# EAGLE design Bus_isolator_trager (EAGLE 6.6.0)
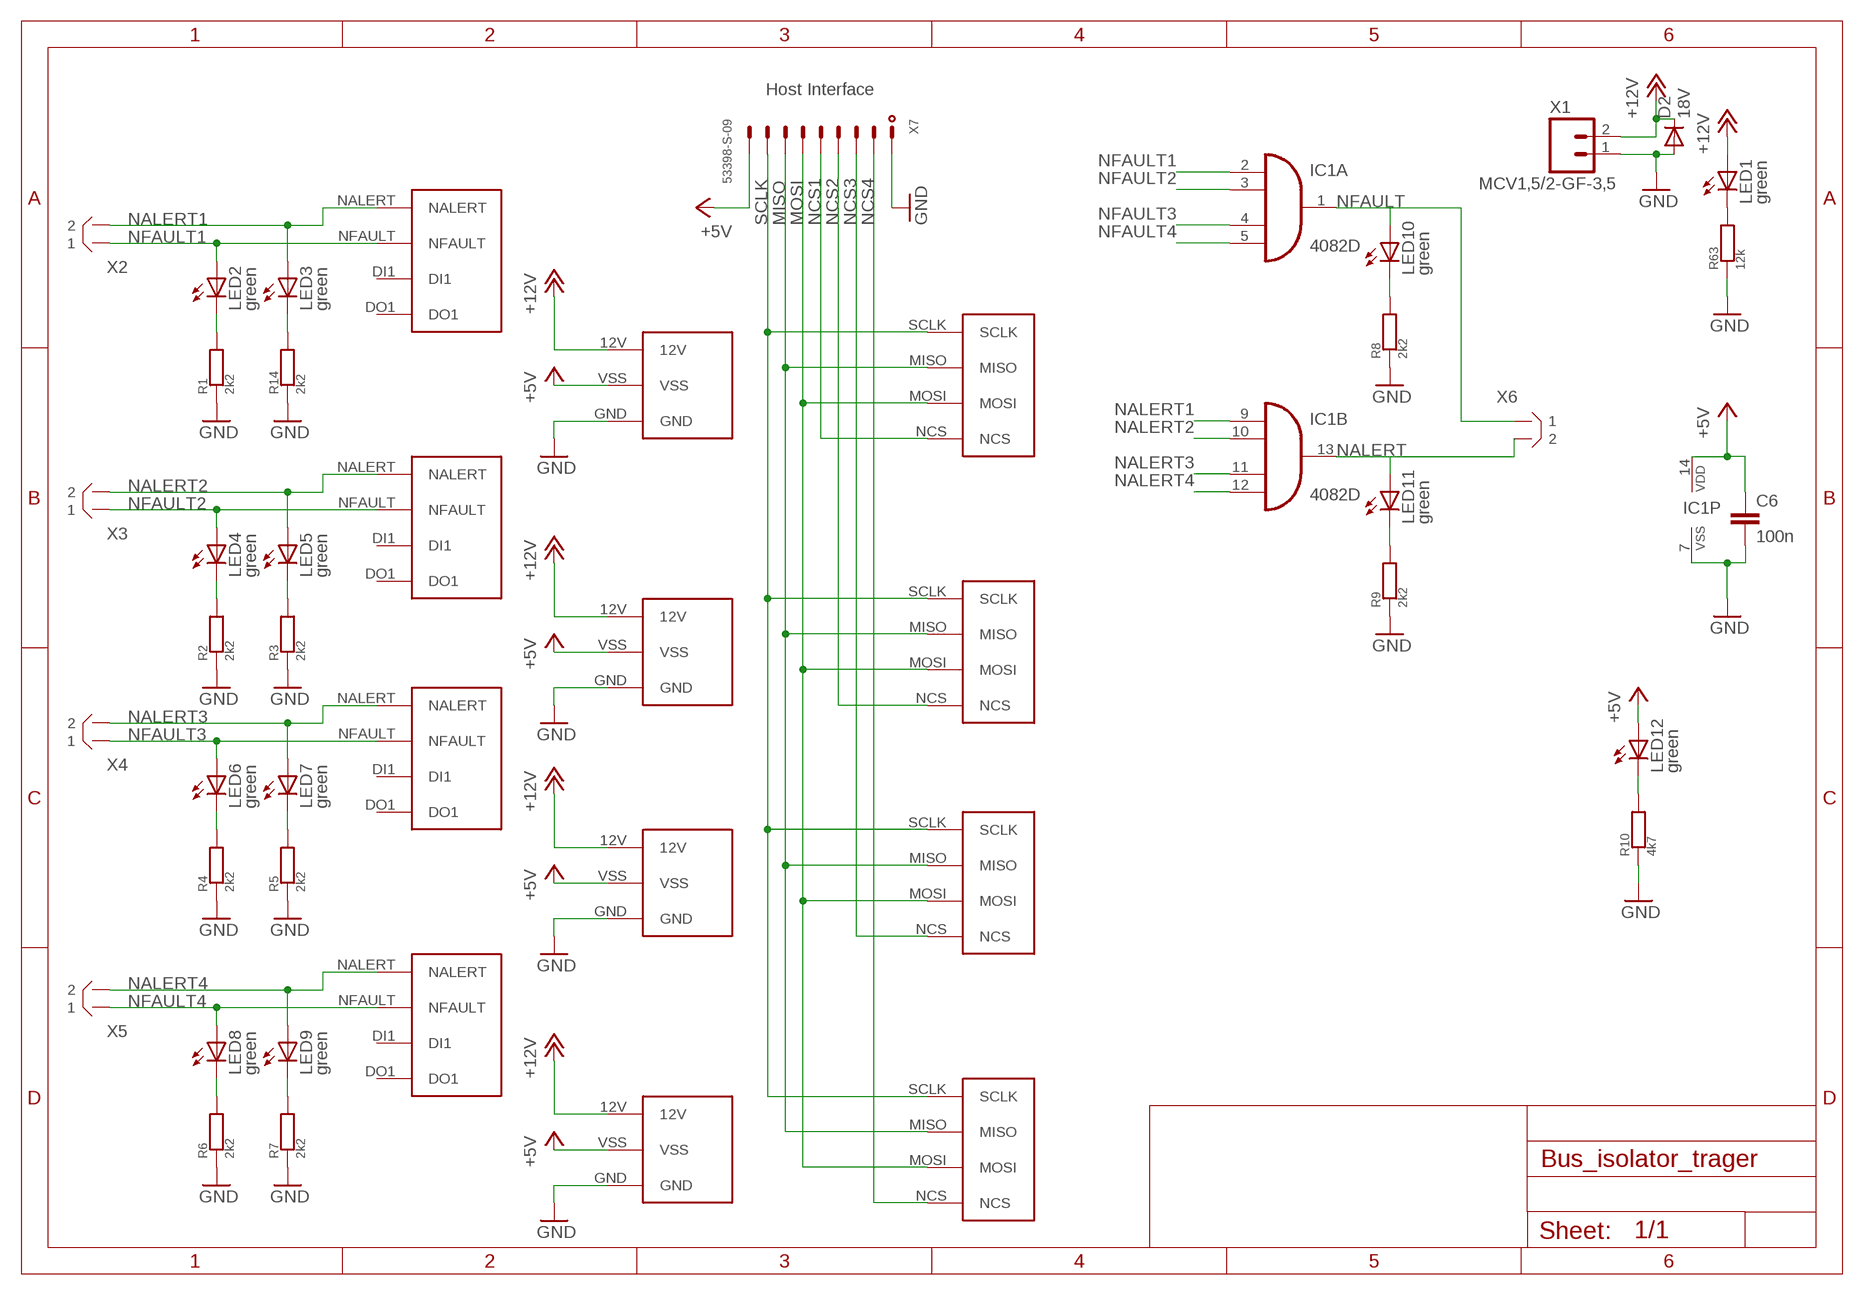
[diagram p0: schematic, sheet 1]

## Parts
A1  SPI_ISOLATOR_V4  [SPI_ISOLATOR_V4]
A2  SPI_ISOLATOR_V4  [SPI_ISOLATOR_V4]
A3  SPI_ISOLATOR_V4  [SPI_ISOLATOR_V4]
A4  SPI_ISOLATOR_V4  [SPI_ISOLATOR_V4]
C6  100n  C-EUC0603  [C0603]
D2  18V  DIODE-DO214AA  [DO214AA]
IC1  4082D  [SO14]
LED1  green  LEDCHIP-LED0805  [CHIP-LED0805]
LED2  green  LEDCHIPLED_0805  [CHIPLED_0805]
LED3  green  LEDCHIPLED_0805  [CHIPLED_0805]
LED4  green  LEDCHIPLED_0805  [CHIPLED_0805]
LED5  green  LEDCHIPLED_0805  [CHIPLED_0805]
LED6  green  LEDCHIPLED_0805  [CHIPLED_0805]
LED7  green  LEDCHIPLED_0805  [CHIPLED_0805]
LED8  green  LEDCHIPLED_0805  [CHIPLED_0805]
LED9  green  LEDCHIPLED_0805  [CHIPLED_0805]
LED10  green  LEDCHIPLED_0805  [CHIPLED_0805]
LED11  green  LEDCHIPLED_0805  [CHIPLED_0805]
LED12  green  LEDCHIP-LED0805  [CHIP-LED0805]
R1  2k2  R0603  [R0603]
R2  2k2  R0603  [R0603]
R3  2k2  R0603  [R0603]
R4  2k2  R0603  [R0603]
R5  2k2  R0603  [R0603]
R6  2k2  R0603  [R0603]
R7  2k2  R0603  [R0603]
R8  2k2  R0603  [R0603]
R9  2k2  R0603  [R0603]
R10  4k7  R0603  [R0603]
R14  2k2  R0603  [R0603]
R63  12k  R0603  [R0603]
X1  MCV1,5/2-GF-3,5  [MCV1,5/2-GF-3,5]
X2  B2B-XH  [B2B-XH]
X3  B2B-XH  [B2B-XH]
X4  B2B-XH  [B2B-XH]
X5  B2B-XH  [B2B-XH]
X6  B2B-XH  [B2B-XH]
X7  53398-S-09  [53398-09-S]

## Nets
+5V: A1.VSS A2.VSS A3.VSS A4.VSS C6.1 IC1.14(P:VDD) LED12.A X7.9
+12V: A1.12V A2.12V A3.12V A4.12V D2.C LED1.A X1.2
GND: A1.GND A2.GND A3.GND A4.GND C6.2 D2.A IC1.7(P:VSS) R1.1 R2.1 R3.1 R4.1 R5.1 R6.1 R7.1 R8.1 R9.1 R10.1 R14.1 R63.1 X1.1 X7.1
MISO: A1.MISO A2.MISO A3.MISO A4.MISO X7.7
MOSI: A1.MOSI A2.MOSI A3.MOSI A4.MOSI X7.6
N$1: LED2.C R1.2
N$2: LED4.C R2.2
N$3: LED5.C R3.2
N$4: LED6.C R4.2
N$5: LED7.C R5.2
N$6: LED8.C R6.2
N$7: LED9.C R7.2
N$8: LED10.C R8.2
N$9: LED11.C R9.2
N$10: LED12.C R10.2
N$29: LED3.C R14.2
N$54: LED1.C R63.2
NALERT: IC1.13(B:O) LED11.A X6.P$2
NALERT1: A1.NALERT IC1.9(B:I0) LED3.A X2.P$2
NALERT2: A2.NALERT IC1.10(B:I1) LED5.A X3.P$2
NALERT3: A3.NALERT IC1.11(B:I2) LED7.A X4.P$2
NALERT4: A4.NALERT IC1.12(B:I3) LED9.A X5.P$2
NCS1: A1.NCS X7.5
NCS2: A2.NCS X7.4
NCS3: A3.NCS X7.3
NCS4: A4.NCS X7.2
NFAULT: IC1.1(A:O) LED10.A X6.P$1
NFAULT1: A1.NFAULT IC1.2(A:I0) LED2.A X2.P$1
NFAULT2: A2.NFAULT IC1.3(A:I1) LED4.A X3.P$1
NFAULT3: A3.NFAULT IC1.4(A:I2) LED6.A X4.P$1
NFAULT4: A4.NFAULT IC1.5(A:I3) LED8.A X5.P$1
SCLK: A1.SCLK A2.SCLK A3.SCLK A4.SCLK X7.8
Unconnected: A1.DI1 A1.DO1 A2.DI1 A2.DO1 A3.DI1 A3.DO1 A4.DI1 A4.DO1

## Notes on the sheet
- Host Interface

## Library data of the parts
A1-A4 = tera-boards:SPI_ISOLATOR_V4
C6 = rcl:C-EU: CAPACITOR, European symbol
D2 = diode:DIODE-: DIODE
IC1 = 40xx:4082: Dual 4-input AND
LED1-LED12 = led:LED: LED OSRAM: - CHIPLED LG R971, LG N971, LY N971, LG Q971, LY Q971, LO R971, LY R971 LH N974, LH R974 LS Q976, LO Q976, LY Q976 LO Q996 - Hyper CHIPLED LW Q18S LB Q993, LB Q99A, LB R99A - SideLED LS A670, LO A670, LY A670, LG A670, LP A670 LB A673, LV A673, LT A673, LW A673 LH A674 LY A675 LS A676, LA A676, LO A676, LY A676, LW A676 LS A679, LY A679, LG A679 - Hyper Micro SIDELED® LS Y876, LA Y876, LO Y876, LY Y876 LT Y87S - SmartLED LW L88C, LW L88S LB L89C, LB L89S, LG L890 LS L89K, LO L89K, LY L89K LS L896, LA L896, LO L896, LY L896 - TOPLED LS T670, LO T670, LY T670, LG T670, LP T670 LSG T670, LSP T670, LSY T670, LOP T670, LYG T670 LG T671, LOG T671, LSG T671 LB T673, LV T673, LT T673, LW T673 LH T674 LS T676, LA T676, LO T676, LY T676, LB T676, LH T676, LSB T676, LW T676 LB T67C, LV T67C, LT T67C, LS T67K, LO T67K, LY T67K, LW E67C LS E67B, LA E67B, LO E67B, LY E67B, LB E67C, LV E67C, LT E67C LW T67C LS T679, LY T679, LG T679 LS T770, LO T770, LY T770, LG T770, LP T770 LB T773, LV T773, LT T773, LW T773 LH T774 LS E675, LA E675, LY E675, LS T675 LS T776, LA T776, LO T776, LY T776, LB T776 LHGB T686 LT T68C, LB T68C - Hyper Mini TOPLED® LB M676 - Mini TOPLED Santana® LG M470 LS M47K, LO M47K, LY M47K Source: http://www.osram.convergy.de LUXEON: - LUMILED® LXK2-PW12-R00, LXK2-PW12-S00, LXK2-PW14-U00, LXK2-PW14-V00 LXK2-PM12-R00, LXK2-PM12-S00, LXK2-PM14-U00 LXK2-PE12-Q00, LXK2-PE12-R00, LXK2-PE12-S00, LXK2-PE14-T00, LXK2-PE14-U00 LXK2-PB12-K00, LXK2-PB12-L00, LXK2-PB12-M00, LXK2-PB14-N00, LXK2-PB14-P00, LXK2-PB14-Q00 LXK2-PR12-L00, LXK2-PR12-M00, LXK2-PR14-Q00, LXK2-PR14-R00 LXK2-PD12-Q00, LXK2-PD12-R00, LXK2-PD12-S00 LXK2-PH12-R00, LXK2-PH12-S00 LXK2-PL12-P00, LXK2-PL12-Q00, LXK2-PL12-R00 Source: www.luxeon.com KINGBRIGHT: KA-3528ASYC Source: www.kingbright.com
R1-R10 R14 R63 = useful:R
X1 = con-phoenix:MCV1,5/2-GF-3,5
X2-X6 = con-jst-xh:?2B-XH
X7 = con-molex:53?-09: CONNECTOR wire to board 1.25 mm (.049 inch) pitch header

## Board
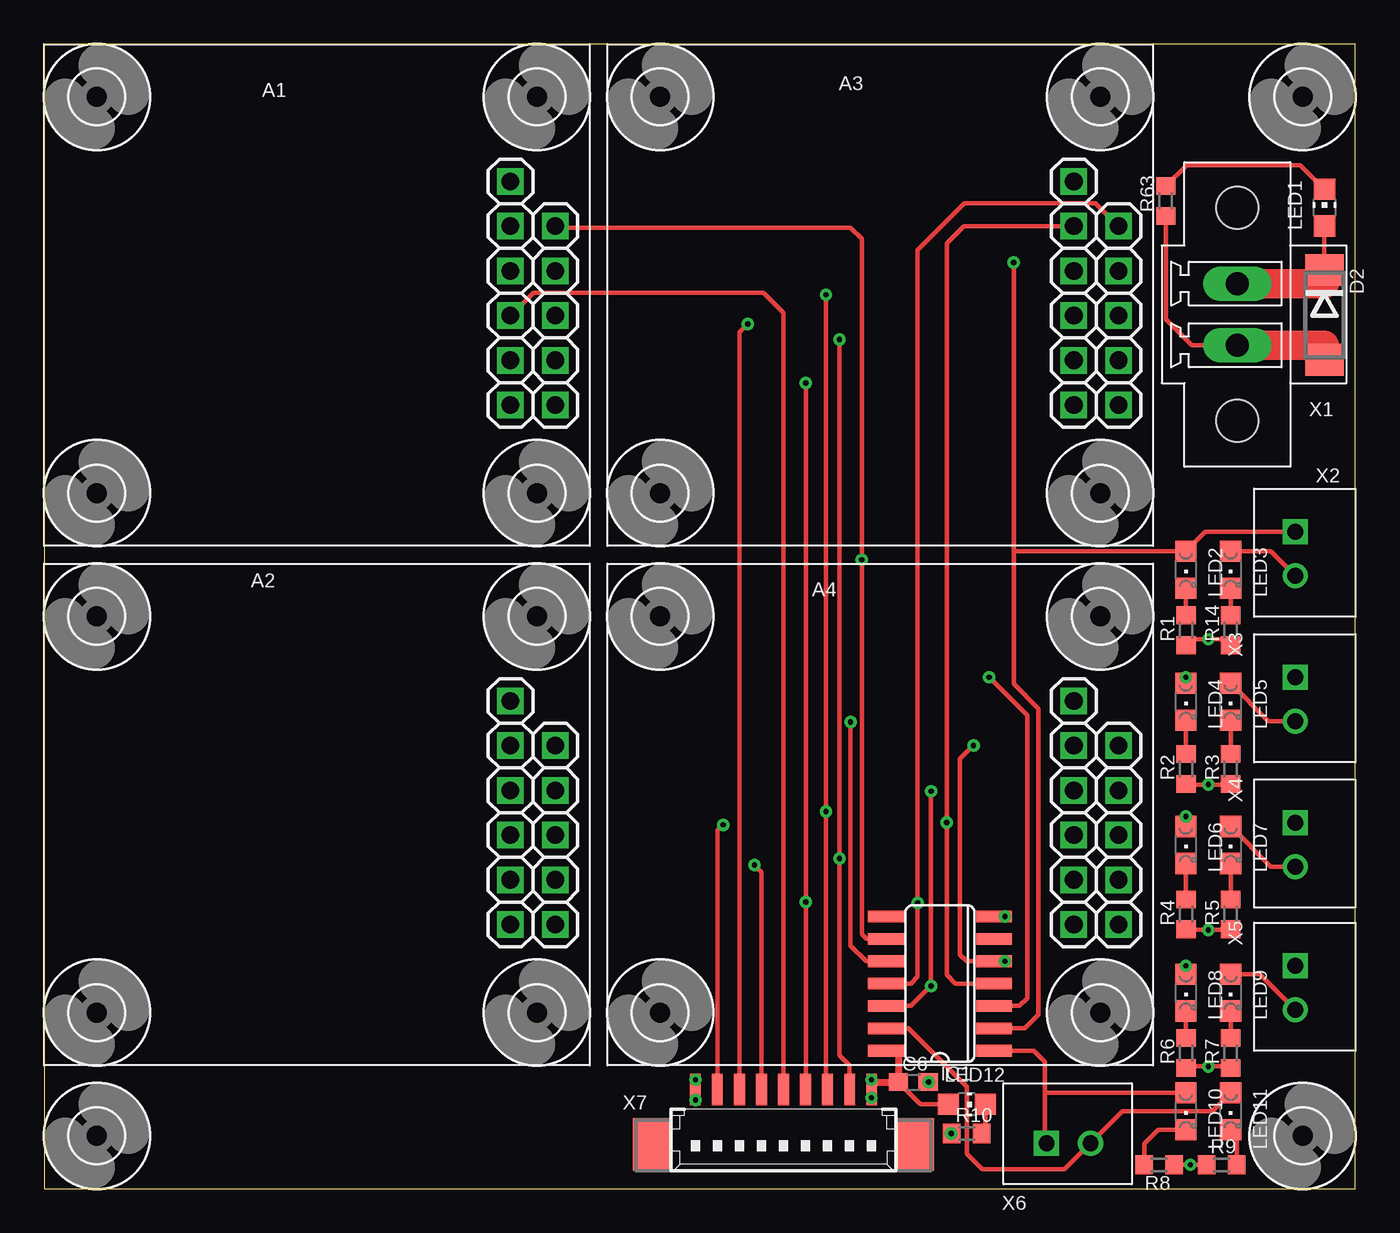
[diagram p1: board, top side]
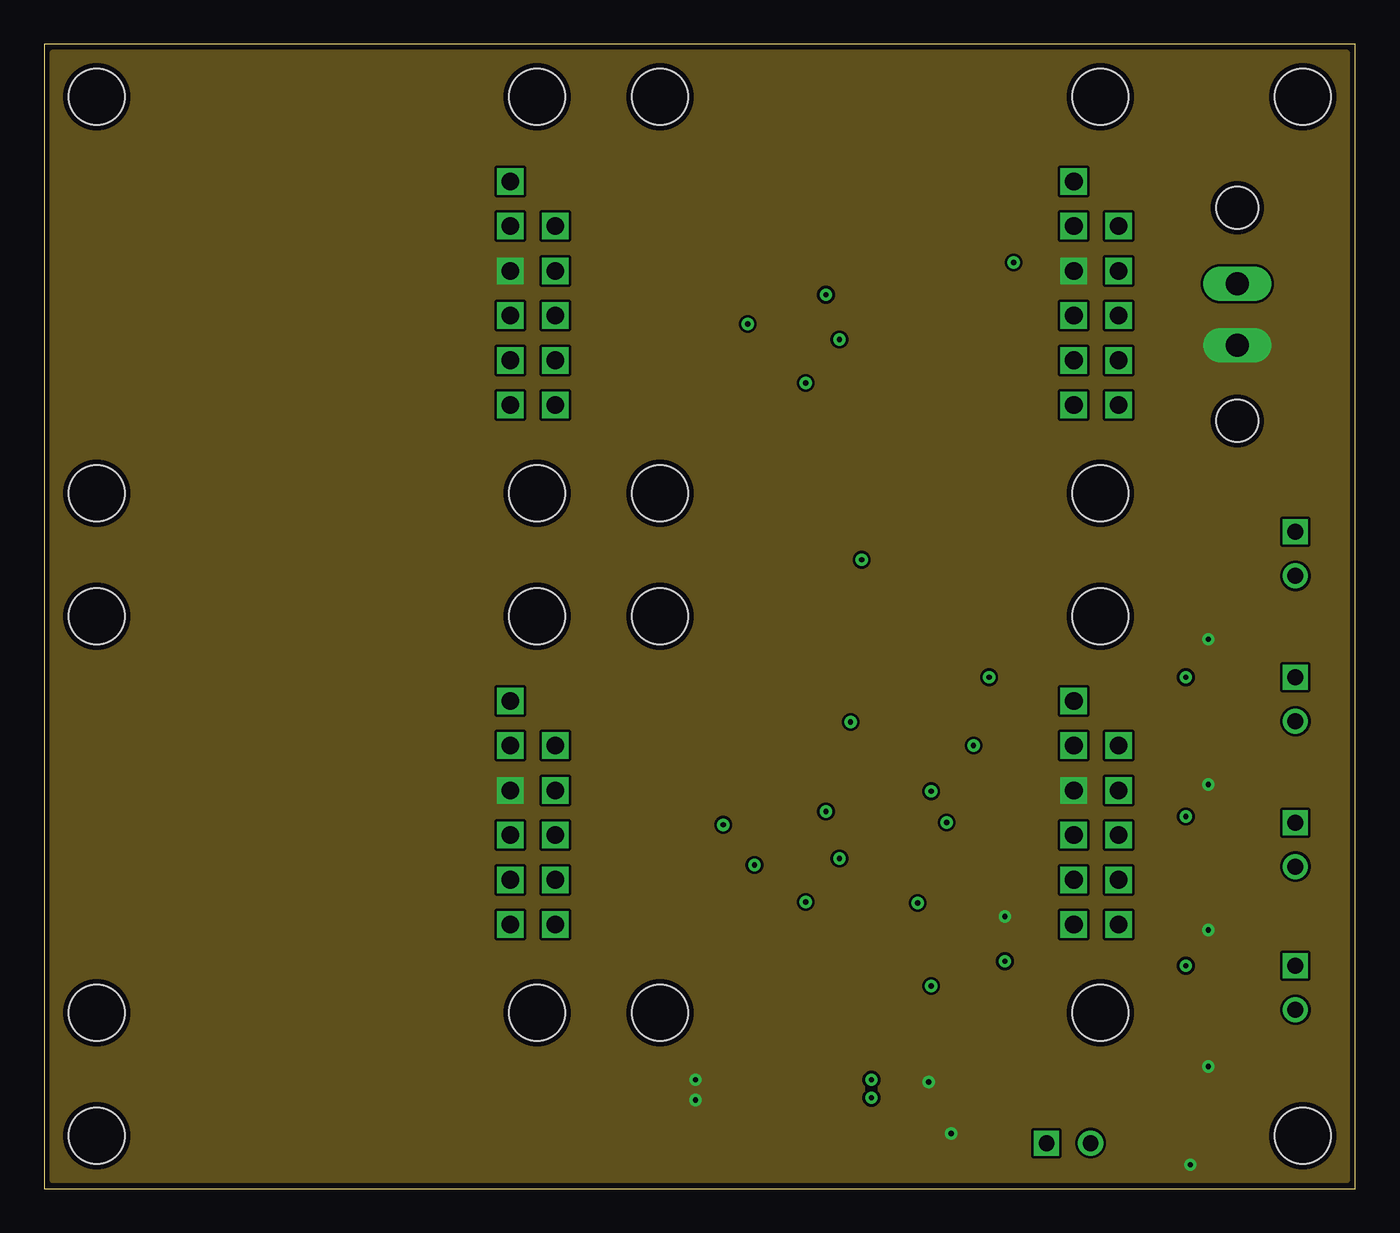
[diagram p2: board, inner layer Route2]
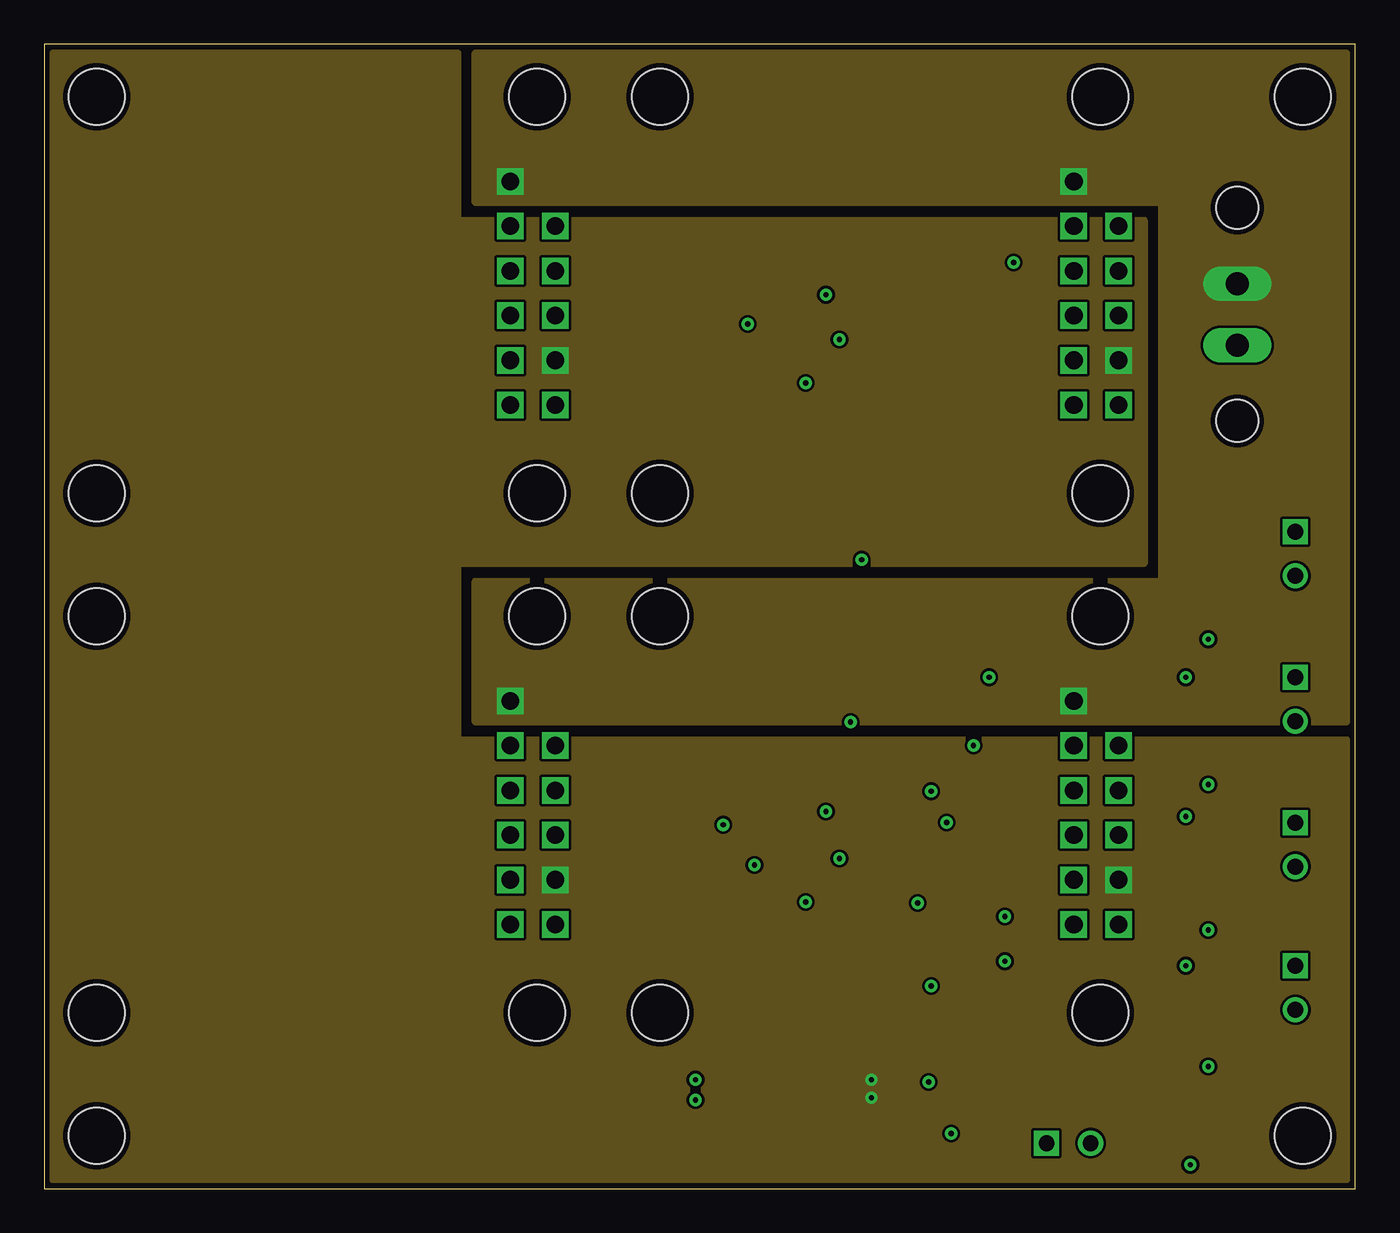
[diagram p3: board, inner layer Route15]
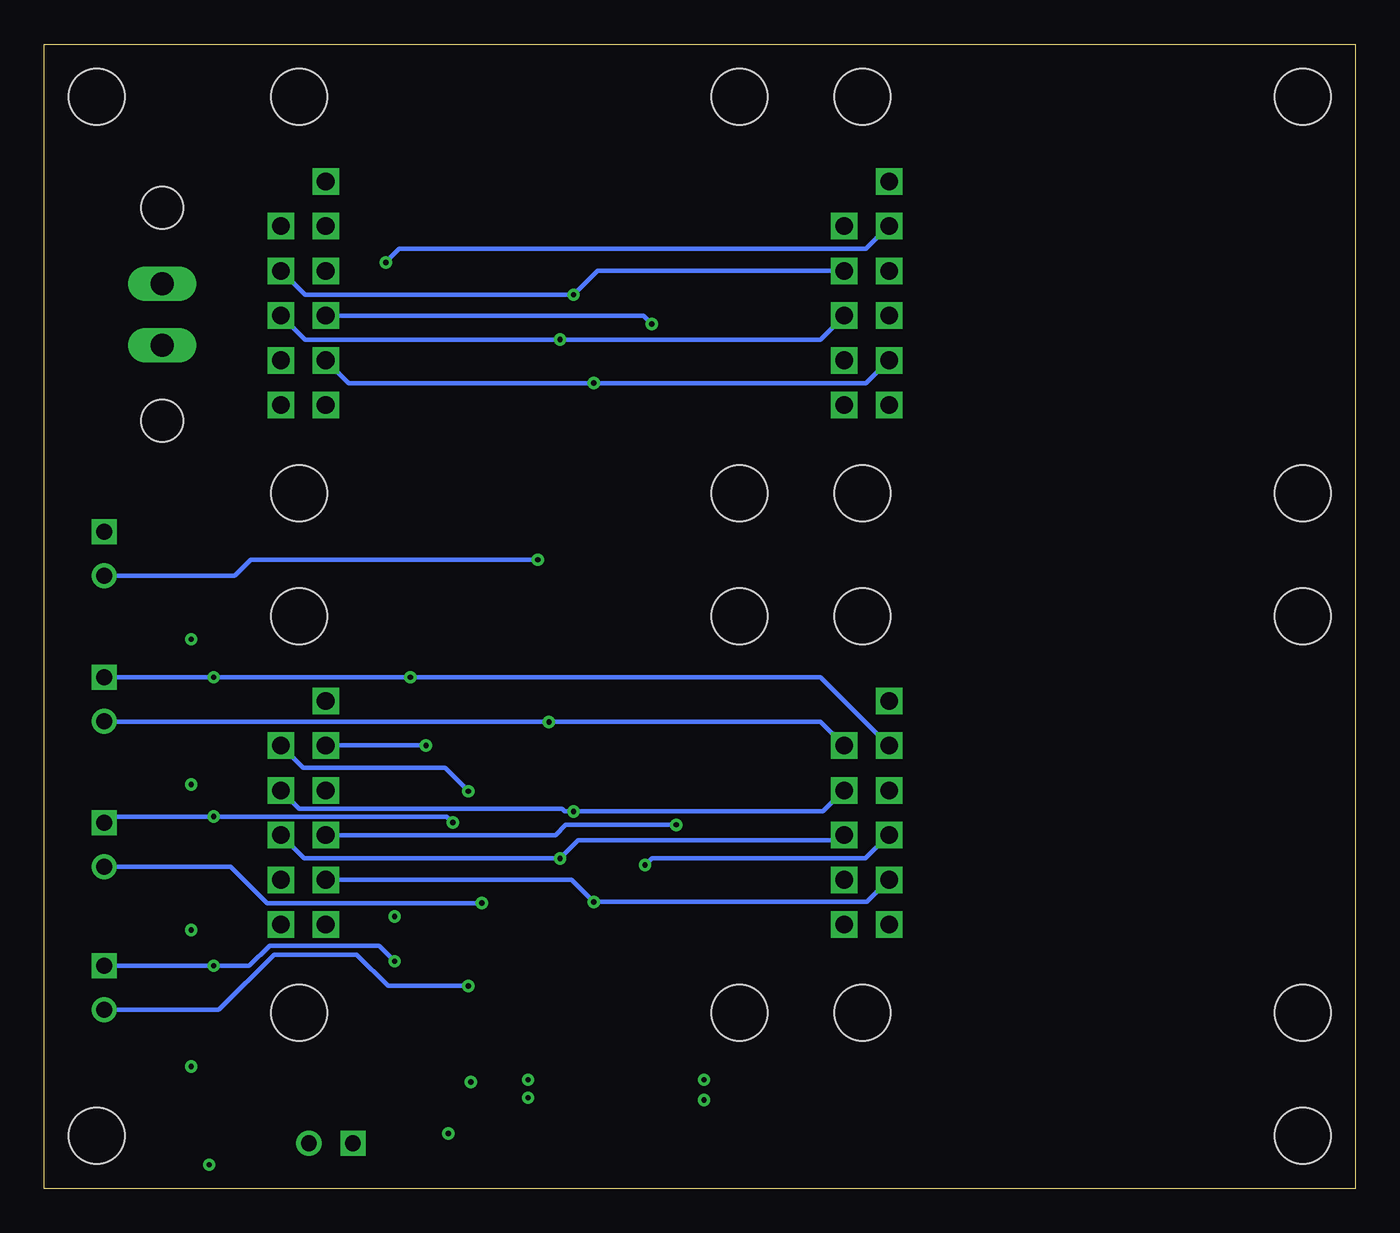
[diagram p4: board, bottom side, seen from below]

Size 74.5 x 65 mm. Coordinates in mm from the lower left corner, seen from the top.
Outline: 0,0 74.5,0 74.5,65 0,65 0,0
Copper layers (1+2*15+16): Top 0.035mm / dielectric 0.2mm / Route2 0.035mm / dielectric 0.5mm / Route15 0.035mm / dielectric 0.2mm / Bottom 0.035mm
Design rules "ats_35u_4layer *": minimum track width 6mil, minimum drill 0.2mm, track to track 6mil, track to pad 6mil, pad to pad 6mil, via to via 6mil, smd to smd 6mil, copper to edge 0.3mm, drill to drill 8mil, minimum pad ring 10mil, minimum via ring 0.2mm, stop-mask expansion 4mil, vias tented up to drill 0mil, thermal gap 10mil

### Footprints (pad centres in the part's own frame; a part is rotated, then mirrored left to right if it is on the bottom)
SPI_ISOLATOR_V4 = drill 1 square: 12V -1.5,17.7; DI1 -1.5,5; DO1 1.04,5; GND -1.5,12.62; MISO 1.04,12.62; MOSI -1.5,7.54; NALERT 1.04,15.16; NCS -1.5,10.08; NFAULT -1.5,15.16; SCLK 1.04,10.08; VSS 1.04,7.54 | hole 3.2: 0,0; 0,22.5; -25,0; -25,22.5
C0603 = smd 1.1 x 1: 1 -0.85,0; 2 0.85,0
DO214AA = smd 1.8 x 2.2: A 2.55,0; C -2.55,0
SO14 = smd 0.66 x 2.032: 1 -3.81,-3.073; 2 -2.54,-3.073; 3 -1.27,-3.073; 4 0,-3.073; 5 1.27,-3.073; 6 2.54,-3.073; 7 3.81,-3.073; 8 3.81,3.073; 9 2.54,3.073; 10 1.27,3.073; 11 0,3.073; 12 -1.27,3.073; 13 -2.54,3.073; 14 -3.81,3.073
CHIP-LED0805 = smd 1.2 x 1.2: A 0,-1.05; C 0,1.05
CHIPLED_0805 = smd 1.2 x 1.2: A 0,-1.05; C 0,1.05
R0603 = smd 1 x 1.1: 1 -0.85,0; 2 0.85,0
3,2 = hole 3.2: 0,0
MCV1,5/2-GF-3,5 = drill 1.3 long: 1 0,3.5; 2 0,0 | hole 2.4: 0,7.8; 0,-4.3
B2B-XH = drill 0.9 pad 1.422 square: P$1 0,0 | drill 0.9 pad 1.422: P$2 2.5,0
53398-09-S = smd 0.6 x 1.8: 1 5,-2.5; 2 3.75,-2.5; 3 2.5,-2.5; 4 1.25,-2.5; 5 0,-2.5; 6 -1.25,-2.5; 7 -2.5,-2.5; 8 -3.75,-2.5; 9 -5,-2.5 | smd 2.1 x 3: S1 7.5,0.625; S2 -7.5,0.625

### Placement (x,y rotation side)
A1  28,39.5 0 top
A2  28,10 0 top
A3  60,39.5 0 top
A4  60,10 0 top
C6  49.38,6.05 0 top
D2  72.74,49.62 270 top
IC1  50.9,11.64 90 top
LED1  72.74,55.71 0 top
LED2  64.87,35.14 180 top
LED3  67.41,35.14 180 top
LED4  64.87,27.65 180 top
LED5  67.41,27.65 180 top
LED6  64.87,19.52 180 top
LED7  67.41,19.52 180 top
LED8  64.87,11.14 180 top
LED9  67.41,11.14 180 top
LED10  64.87,4.41 180 top
LED11  67.41,4.41 180 top
LED12  52.42,4.79 270 top
R1  64.87,31.71 90 top
R2  64.87,23.84 90 top
R3  67.41,23.84 90 top
R4  64.87,15.58 90 top
R5  67.41,15.58 90 top
R6  64.87,7.71 90 top
R7  67.41,7.71 90 top
R8  63.34,1.36 180 top
R9  66.9,1.36 0 top
R10  52.42,3.13 0 top
R14  67.41,31.71 90 top
R63  63.72,56.09 90 top
U$5  [3,2]  3,3 0 top
U$7  [3,2]  71.5,3 0 top
U$8  [3,2]  71.5,62 0 top
X1  67.79,51.4 180 top
X2  71.09,37.3 270 top
X3  71.09,29.04 270 top
X4  71.09,20.79 270 top
X5  71.09,12.66 270 top
X6  56.95,2.59 0 top
X7  42.01,3.13 180 top

### Tracks (layer width: path | path; a pad name or v marks a point on that pad's centre or on a via)
+5V  (via drill 0.3)
  Top 0.254: LED12.A 49.8,4.79 C6.1 | v47.01,6.18 46.96,6.18 46.96,5.68 X7.9
  Top 0.406: X7.9 47.01,6.05 C6.1 48.53,7.83 IC1.14
  other vias: 47.01,5.17
  pour Route15 (no thermals): 74,25.5 74,0.5 0.5,0.5 0.5,64.5 23.5,64.5 23.5,55 62.5,55 62.5,35.5 23.5,35.5 23.5,25.5
+12V
  Top 0.254: D2.C LED1.A
  Top 1.676: X1.2 72.74,51.4 D2.C
  pour Route15 (no thermals): 24.5,64.5 74,64.5 74,26.5 24.5,26.5 24.5,34.5 63.5,34.5 63.5,56 24.5,56
GND  (via drill 0.3)
  Top 0.254: v37.01,6.18 X7.1 | C6.2 50.25,6.05 v50.26,6.06 | R10.1 v51.53,3.13 | R3.1 67.37,22.95 v66.14,22.95 64.91,22.95 R2.1 | R5.1 67.37,14.69 v66.14,14.69 64.91,14.69 R4.1 | R6.1 64.95,6.95 v66.14,6.95 67.32,6.95 R7.1 | R8.1 v65.12,1.36 R9.1 | IC1.7 v54.58,15.45 | R63.1 63.72,49.36 65.19,47.9 X1.1 | R1.1 64.87,31.2 v66.14,31.2 67.41,31.2 R14.1
  Top 1.676: X1.1 72.74,47.9 D2.A
  other vias: 37.01,5.04
  pour Route2 (no thermals): 0.5,64.5 74,64.5 74,0.5 0.5,0.5
MISO  (via drill 0.3)
  Top 0.254: v44.42,50.76 v44.42,21.42 44.42,5.63 X7.7
  Bottom 0.254: A3.MISO 59.68,50.76 v44.42,50.76 43.06,52.12 A1.MISO | A4.MISO 60,21.57 45.08,21.57 44.93,21.42 v44.42,21.42 30.24,21.42 A2.MISO
MOSI  (via drill 0.3)
  Top 0.254: v43.28,45.74 v43.28,16.28 43.28,5.63 X7.6
  Bottom 0.254: A2.MOSI 27.76,16.28 v43.28,16.28 v43.28,16.29 44.53,17.54 A4.MOSI | A1.MOSI 27.8,45.74 v43.28,45.74 57.2,45.74 A3.MOSI
N$1
  Top 0.254: LED2.C R1.2
N$2
  Top 0.254: LED4.C R2.2
N$3
  Top 0.254: LED5.C R3.2
N$4
  Top 0.254: LED6.C R4.2
N$5
  Top 0.254: LED7.C R5.2
N$6
  Top 0.254: R6.2 LED8.C
N$7
  Top 0.254: LED9.C R7.2
N$8
  Top 0.254: LED10.C 63.31,3.35 62.49,2.54 R8.2
N$9
  Top 0.254: LED11.C 67.75,3.35 R9.2
N$10
  Top 0.254: LED12.C 53.47,3.33 R10.2
N$29
  Top 0.254: LED3.C R14.2
N$54
  Top 0.254: R63.2 64.91,58.13 71.38,58.13 LED1.C
NALERT
  Top 0.254: LED11.A 66.36,4.41 61.27,4.41 X6.P$2 57.97,1.1 53.31,1.1 52.42,1.99 52.42,5.8 49.12,9.1 IC1.13
NALERT1  (via drill 0.3)
  Top 0.254: IC1.9 46.7,14.18 46.45,14.44 v46.45,35.71 46.45,53.94 45.82,54.57 29.13,54.57 A1.NALERT | LED3.A 69.7,36.19 X2.P$2
  Bottom 0.254: v46.45,35.71 62.77,35.71 63.68,34.8 X2.P$2
NALERT2  (via drill 0.3)
  Top 0.254: v45.82,26.5 45.82,13.8 46.7,12.91 IC1.10 | LED5.A 69.56,26.54 X3.P$2
  Bottom 0.254: A2.NALERT 30.38,26.5 v45.82,26.5 71.09,26.5 X3.P$2
NALERT3  (via drill 0.3)
  Top 0.254: IC1.11 49.24,11.64 49.63,12.03 v49.63,16.22 49.63,53.3 52.29,55.97 59.73,55.97 A3.NALERT | LED7.A 69.69,18.29 X4.P$2
  Bottom 0.254: X4.P$2 63.89,18.29 61.82,16.22 v49.63,16.22
NALERT4  (via drill 0.3)
  Top 0.254: v50.39,22.57 v50.39,11.52 49.24,10.37 IC1.12 | LED9.A 69.06,12.19 X5.P$2
  Bottom 0.254: v50.39,22.57 51.72,23.9 59.78,23.9 A4.NALERT | X5.P$2 64.57,10.16 61.44,13.29 56.74,13.29 54.96,11.52 v50.39,11.52
NCS1
  Top 0.254: X7.5 42.01,49.74 40.86,50.89 27.81,50.89 A1.NCS
NCS2  (via drill 0.3)
  Top 0.254: v40.35,18.38 40.76,17.97 X7.4
  Bottom 0.254: A2.NCS 27.82,18.76 39.97,18.76 v40.35,18.38
NCS3  (via drill 0.3)
  Top 0.254: X7.3 39.51,48.64 v39.97,49.11
  Bottom 0.254: 40.16,49.3 v39.97,49.11 40.45,49.58 A3.NCS
NCS4  (via drill 0.3)
  Top 0.254: X7.2 38.26,20.34 v38.58,20.66
  Bottom 0.254: v38.58,20.66 44.86,20.66 45.44,20.08 A4.NCS
NFAULT
  Top 0.254: IC1.1 56.23,7.83 56.87,7.2 56.87,5.55 | 56.87,5.55 56.87,2.68 X6.P$1 | LED10.A 56.96,5.46 56.87,5.55
NFAULT1  (via drill 0.3)
  Top 0.254: v55.09,52.6 55.09,36.19 | 55.09,36.19 55.09,28.66 56.48,27.27 56.48,9.87 55.72,9.1 IC1.2 | 55.09,36.19 LED2.A 65.97,37.3 X2.P$1
  Bottom 0.254: A1.NFAULT 27.8,53.36 54.33,53.36 v55.09,52.6
NFAULT2  (via drill 0.3)
  Top 0.254: IC1.3 55.4,10.37 55.85,10.82 55.85,26.88 v53.69,29.04 | LED4.A v64.87,29.04
  Bottom 0.254: X3.P$1 v64.87,29.04 v53.69,29.04 30.38,29.04 A2.NFAULT
NFAULT3  (via drill 0.3)
  Top 0.254: IC1.4 51.78,11.64 51.28,12.15 v51.28,20.79 51.28,53.68 52.26,54.66 A3.NFAULT | LED6.A v64.87,21.13
  Bottom 0.254: X4.P$1 70.75,21.13 v64.87,21.13 51.62,21.13 v51.28,20.79
NFAULT4  (via drill 0.3)
  Top 0.254: v52.8,25.17 52.04,24.41 52.04,13.29 52.42,12.91 IC1.5 v54.58,12.91 | LED8.A v64.87,12.66
  Bottom 0.254: v52.8,25.17 A4.NFAULT | X5.P$1 v64.87,12.66 62.83,12.66 61.69,13.8 55.47,13.8 v54.58,12.91
SCLK  (via drill 0.3)
  Top 0.254: v45.18,48.22 v45.18,18.76 45.18,7.58 45.76,7 X7.8
  Bottom 0.254: A4.SCLK 59.72,18.76 v45.18,18.76 44.16,19.77 29.04,19.77 A2.SCLK | A1.SCLK 30.4,48.22 v45.18,48.22 59.68,48.22 A3.SCLK

### Text on the board
tTest: Fault | Alert